# Altium schematic sheet 04_Sensor.SchDoc
size A4
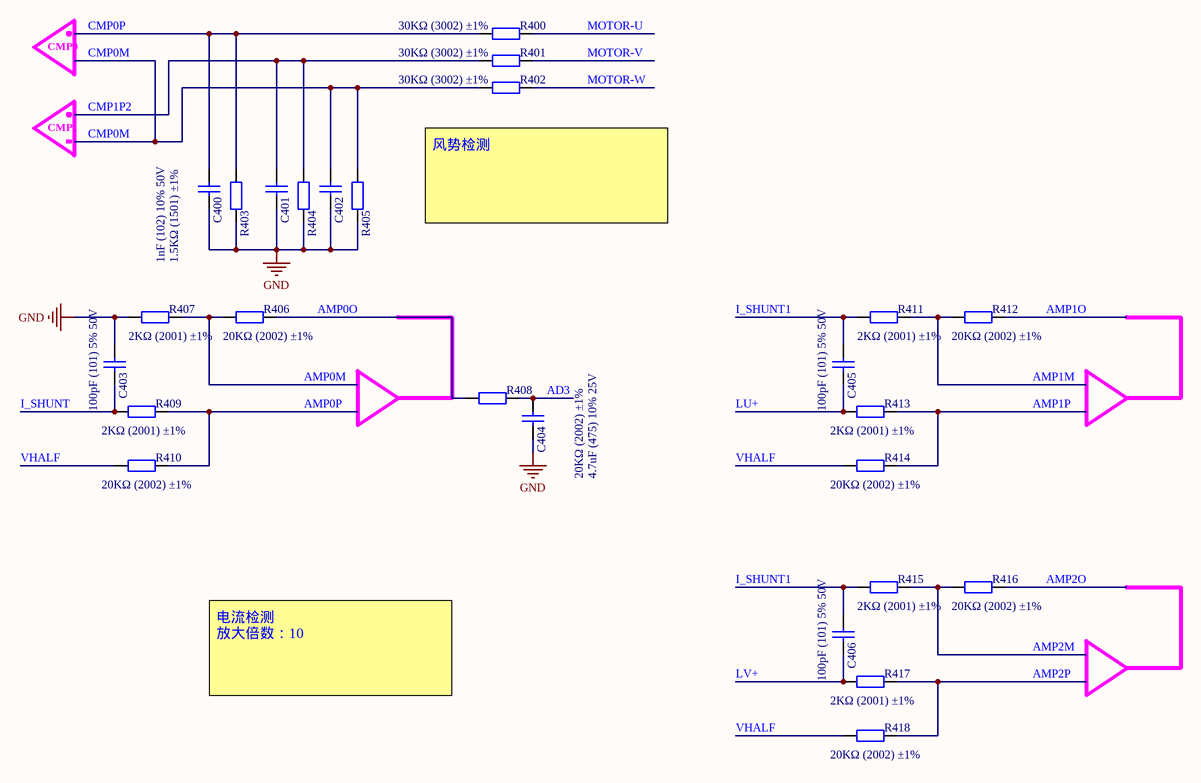
[diagram p0: 04_Sensor.SchDoc]

## Parts
C400  1nF (102) 10% 50V  [0805_C]
C401  1nF (102) 10% 50V  [0805_C]  (value not drawn)
C402  1nF (102) 10% 50V  [0805_C]  (value not drawn)
C403  100pF (101) 5% 50V  [0805_C]
C404  4.7uF (475) 10% 25V  [0805_C]
C405  100pF (101) 5% 50V  [0805_C]
C406  100pF (101) 5% 50V  [0805_C]
R400  30KΩ (3002) ±1%  [0805_R]
R401  30KΩ (3002) ±1%  [0805_R]
R402  30KΩ (3002) ±1%  [0805_R]
R403  1.5KΩ (1501) ±1%  [0805_R]
R404  1.5KΩ (1501) ±1%  [0805_R]  (value not drawn)
R405  1.5KΩ (1501) ±1%  [0805_R]  (value not drawn)
R406  20KΩ (2002) ±1%  [0805_R]
R407  2KΩ (2001) ±1%  [0805_R]
R408  20KΩ (2002) ±1%  [0805_R]
R409  2KΩ (2001) ±1%  [0805_R]
R410  20KΩ (2002) ±1%  [0805_R]
R411  2KΩ (2001) ±1%  [0805_R]
R412  20KΩ (2002) ±1%  [0805_R]
R413  2KΩ (2001) ±1%  [0805_R]
R414  20KΩ (2002) ±1%  [0805_R]
R415  2KΩ (2001) ±1%  [0805_R]
R416  20KΩ (2002) ±1%  [0805_R]
R417  2KΩ (2001) ±1%  [0805_R]
R418  20KΩ (2002) ±1%  [0805_R]

## Nets
GND: C400.1 C401.1 C402.1 C403.2 C404.1 R403.1 R404.1 R405.1 R407.1
AD3: C404.2 R408.2
AMP0M: R406.1 R407.2
AMP0O: R406.2 R408.1
AMP0P: R409.2 R410.2
AMP1M: R411.2 R412.1
AMP1O: R412.2
AMP1P: R413.2 R414.2
AMP2M: R415.2 R416.1
AMP2O: R416.2
AMP2P: R417.2 R418.2
CMP0M: C402.2 R402.1 R405.2
CMP0P: C400.2 R400.1 R403.2
CMP1P2: C401.2 R401.1 R404.2
I_SHUNT: C403.1 R409.1
I_SHUNT1: C405.2 C406.2 R411.1 R415.1
LU+: C405.1 R413.1
LV+: C406.1 R417.1
MOTOR-U: R400.2
MOTOR-V: R401.2
MOTOR-W: R402.2
VHALF: R410.1 R414.1 R418.1

## Notes on the sheet
- CMP0
- CMP1
- (near R402) 风势检测
- 电流检测
  放大倍数：10

## Library data of the parts
C400-C402 = 0805 1nF (102) 10% 50V: 贴片电容; ComponentLink1Description: 供应商链接; ComponentLink1URL: http://www.szlcsc.com/product/details_52223.html; Package: 0805; Supplier: LC; SuppliersPartNumber: C51210
C403 C405 C406 = 0805 100pF (101) 5% 50V: 贴片电容; ComponentLink1Description: 供应商链接; ComponentLink1URL: http://www.szlcsc.com/product/details_2142.html; Package: 0805; Supplier: LC; SuppliersPartNumber: C1790
C404 = 0805 4.7uF (475) 10% 25V: 贴片电容; ComponentLink1Description: 供应商链接; ComponentLink1URL: http://www.szlcsc.com/product/details_2131.html; Package: 0805; Supplier: LC; SuppliersPartNumber: C1779
R400-R402 = 0603 30KΩ (3002) 1%: 贴片电阻; ComponentLink1Description: 供应商链接; ComponentLink1URL: http://www.szlcsc.com/product/details_23711.html; Package: 0603; Supplier: LC; SuppliersPartNumber: C22984
R403-R405 = 0805 1.5KΩ (1501) 1%: 贴片电阻; ComponentLink1Description: 供应商链接; ComponentLink1URL: http://www.szlcsc.com/product/details_4717.html; Package: 0805; Supplier: LC; SuppliersPartNumber: C4310
R406 R408 R410 R412 R414 R416 R418 = 0805 20KΩ (2002) 1%: 贴片电阻; ComponentLink1Description: 供应商链接; ComponentLink1URL: http://www.szlcsc.com/product/details_4735.html; Package: 0805; Supplier: LC; SuppliersPartNumber: C4328
R407 R409 R411 R413 R415 R417 = 0805 2KΩ (2001) 1%: 贴片电阻; ComponentLink1Description: 供应商链接; ComponentLink1URL: http://www.szlcsc.com/product/details_18292.html; Package: 0805; Supplier: LC; SuppliersPartNumber: C17604